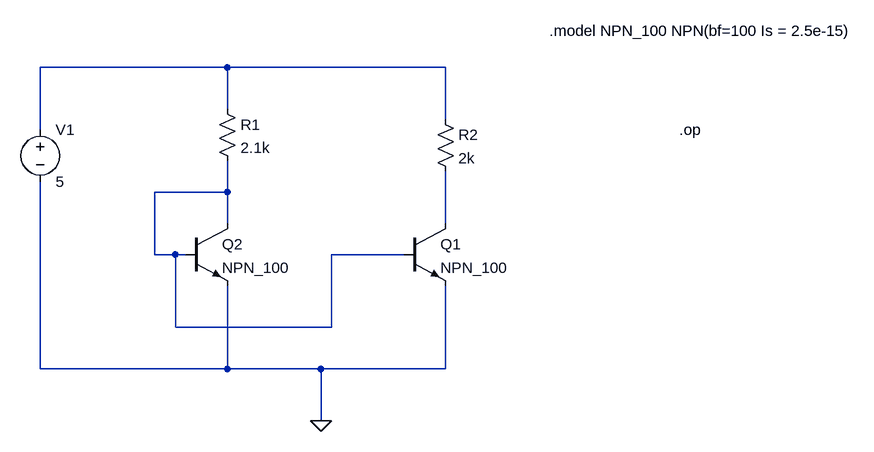
[diagram p0: schematic A02 - Simulacao.asc]
A02 - Simulacao.asc, the LTspice schematic file:
Version 4
SHEET 1 992 680
WIRE -64 -288 -352 -288
WIRE 272 -288 -64 -288
WIRE -64 -224 -64 -288
WIRE 272 -208 272 -288
WIRE -352 -192 -352 -288
WIRE -64 -96 -64 -144
WIRE -64 -96 -176 -96
WIRE -64 -48 -64 -96
WIRE 272 -48 272 -128
WIRE -176 0 -176 -96
WIRE -144 0 -176 0
WIRE -128 0 -144 0
WIRE 208 0 96 0
WIRE -144 112 -144 0
WIRE 96 112 96 0
WIRE 96 112 -144 112
WIRE -352 176 -352 -112
WIRE -64 176 -64 48
WIRE -64 176 -352 176
WIRE 80 176 -64 176
WIRE 272 176 272 48
WIRE 272 176 80 176
WIRE 80 256 80 176
FLAG 80 256 0
SYMBOL npn 208 -48 R0
SYMATTR InstName Q1
SYMATTR Value NPN_100
SYMBOL npn -128 -48 R0
SYMATTR InstName Q2
SYMATTR Value NPN_100
SYMBOL voltage -352 -208 R0
WINDOW 123 0 0 Left 0
WINDOW 39 0 0 Left 0
SYMATTR InstName V1
SYMATTR Value 5
SYMBOL res -80 -240 R0
SYMATTR InstName R1
SYMATTR Value 2.1k
SYMBOL res 256 -224 R0
SYMATTR InstName R2
SYMATTR Value 2k
TEXT 432 -344 Left 2 !.model NPN_100 NPN(bf=100 Is = 2.5e-15)
TEXT 632 -192 Left 2 !.op

The netlist it stands for:
* A02 - Simulacao.asc
Q1 N003 N002 0 0 NPN_100
Q2 N002 N002 0 0 NPN_100
V1 N001 0 5
R1 N001 N002 2.1k
R2 N001 N003 2k
.model NPN NPN
.model PNP PNP
.lib standard.bjt
.model NPN_100 NPN(bf=100 Is = 2.5e-15)
.op
.backanno
.end